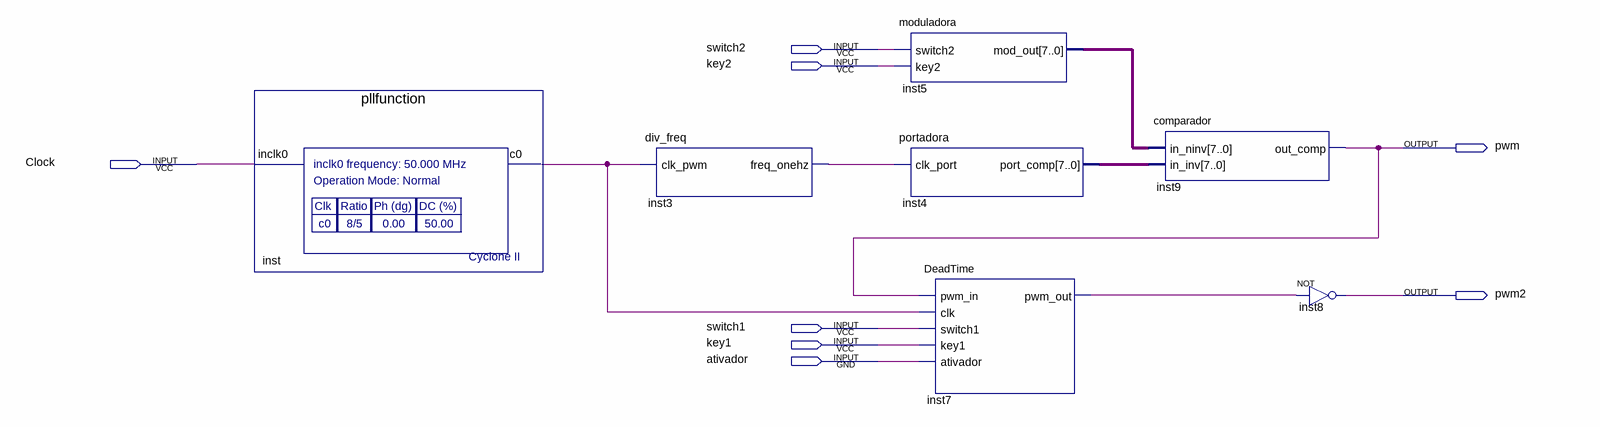
[diagram p0: schematic sheet]
// Quartus schematic PWM_DeadTime.bdf as structural Verilog: 7 symbols, 8 pins
module PWM_DeadTime (
  input  switch2,
  input  key2,
  input  Clock,
  input  switch1,
  input  key1,
  input  ativador,
  output pwm,
  output pwm2
);

  wire inst3_freq_onehz, inst7_pwm_out, inst_c0;
  wire [7:0] inst4_port_comp, inst5_mod_out;

  pllfunction inst (.inclk0(Clock), .c0(inst_c0));
  div_freq inst3 (.clk_pwm(inst_c0), .freq_onehz(inst3_freq_onehz));
  moduladora inst5 (.switch2(switch2), .key2(key2), .mod_out(inst5_mod_out));
  portadora inst4 (.clk_port(inst3_freq_onehz), .port_comp(inst4_port_comp));
  DeadTime inst7 (
    .pwm_in(pwm), .clk(inst_c0), .switch1(switch1), .key1(key1), .ativador(ativador), .pwm_out(inst7_pwm_out));
  comparador inst9 (.in_ninv(inst5_mod_out), .in_inv(inst4_port_comp), .out_comp(pwm));
  not inst8 (pwm2, inst7_pwm_out);
endmodule
